# Altium project Planter.PrjPcb
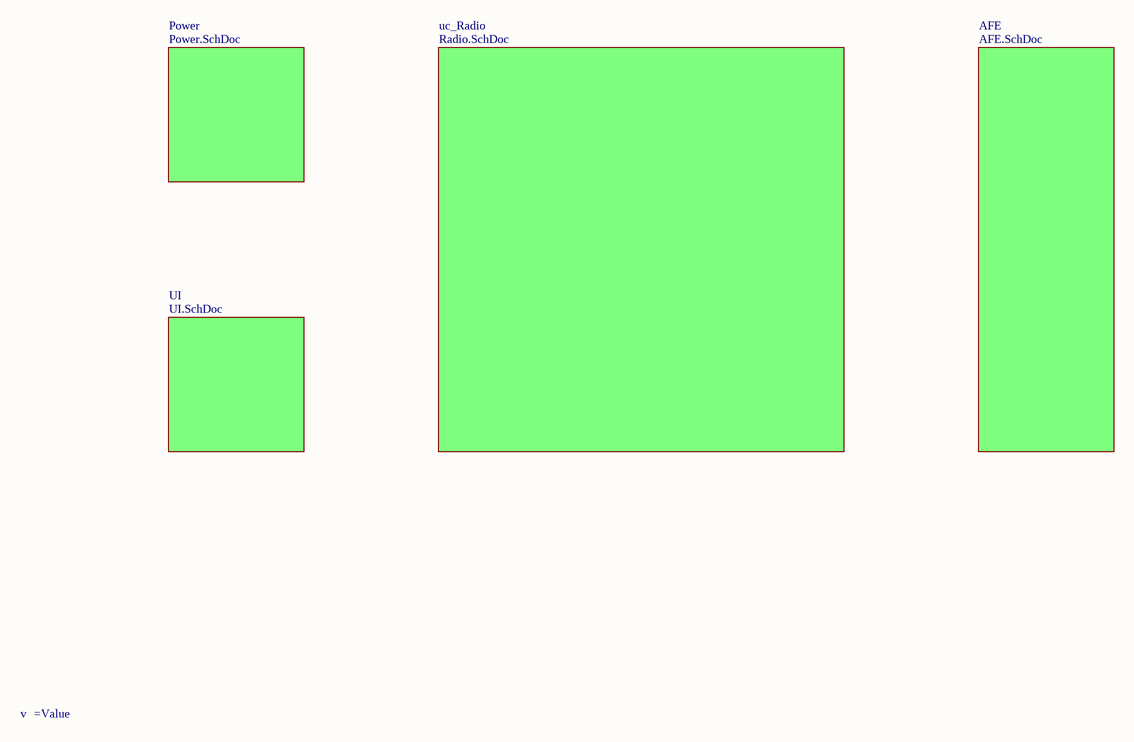
[diagram p0: Planter.SchDoc]
5 sheets, 45 parts. Net scope: global (net labels, ports and power ports of the same name join across sheets).
Board file: Planter.PcbDoc
Sheets:
  Planter.SchDoc
    uc_Radio = radio.SchDoc
    Power = power.SchDoc
    AFE = AFE.SchDoc
    UI = UI.SchDoc

## Sheet Planter.SchDoc: Plant - Block Diagram
size A4; Author: Carlos de la Fuente; DrawnBy: Carlos de la Fuente; Engineer: Carlos de la Fuente; DocumentNumber: 1; Revision: 0.2; SheetNumber: 1; SheetTotal: 5

### Parts
v  Version  [VERSION]  (value not drawn)  (no BOM)

### Sub-sheets
AFE = AFE.SchDoc: no entries
Power = Power.SchDoc: no entries
uc_Radio = Radio.SchDoc: no entries
UI = UI.SchDoc: no entries

### Notes on the sheet
- Title
- Size:
- Date:
- A4
- Project:
- Time:
- Sheet
- Drawn By:
- Revision:
- of
- File:

### Library data of the parts
v = Version: Silkscreen version; Value: 0.2; Part Number: Version; Revision Date: 15/04/2019; Creation Date: 15/04/2019

## Sheet radio.SchDoc: Plant - Radio
size A4; Author: Carlos de la Fuente; DrawnBy: Carlos de la Fuente; DocumentNumber: Radio; Revision: 0.2; SheetNumber: 2; SheetTotal: 5
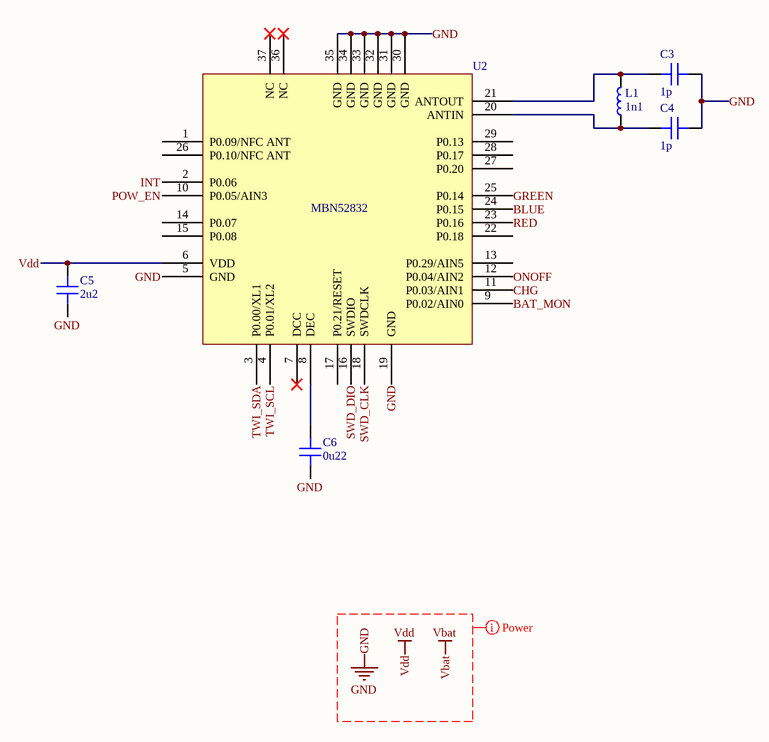
[diagram p1: radio.SchDoc]

### Parts
C3  1p  [CAP 0201/0603]
C4  1p  [CAP 0201/0603]
C5  2u2  [CAP 0402/1005]
C6  0u22  [CAP 0201/0603]
L1  1n1  [FER 0201/0603]
U2  MBN52832  [Murata MBN52832]

### Nets
GND: C3.2 C4.2 C5.1 C6.1 U2.5(GND) U2.19(GND) U2.30(GND) U2.31(GND) U2.32(GND) U2.33(GND) U2.34(GND) U2.35(GND)
Vdd: C5.2 U2.6(VDD)
BAT_MON: U2.9(P0.02/AIN0)
BLUE: U2.24(P0.15)
CHG: U2.11(P0.03/AIN1)
GREEN: U2.25(P0.14)
INT: U2.2(P0.06)
ONOFF: U2.12(P0.04/AIN2)
POW_EN: U2.10(P0.05/AIN3)
RED: U2.23(P0.16)
SWD_CLK: U2.18(SWDCLK)
SWD_DIO: U2.16(SWDIO)
TWI_SCL: U2.4(P0.01/XL2)
TWI_SDA: U2.3(P0.00/XL1)
NetC3_1: C3.1 L1.2 U2.21(ANTOUT)
NetC4_1: C4.1 L1.1 U2.20(ANTIN)
NetC6_2: C6.2 U2.8(DEC)

Not connected (* = marked no-connect by the designer): U2 1(P0.09/NFC_ANT) 7(DCC)* 13(P0.29/AIN5) 14(P0.07) 15(P0.08) 17(P0.21/RESET) 22(P0.18) 26(P0.10/NFC_ANT) 27(P0.20) 28(P0.17) 29(P0.13) 36(NC)* 37(NC)*

### Layout directives
net class Power: GND, Vbat, Vdd

### Notes on the sheet
- Title
- Size:
- Date:
- A4
- Project:
- Time:
- Sheet
- Drawn By:
- Revision:
- of
- File:

### Library data of the parts
C3 C4 = GRM0335C1H1R0BA01D: CAP CER 0201 1pF 50V ±0.1pF C0G; Manufacturer: Murata; Value: 1p; Part Number: GRM0335C1H1R0BA01D; Creation Date: 02/07/2019; Revision Date: 02/07/2019; Supplier 1: Digi-Key; Supplier Part Number 1: 490-9660-1-ND; Manufacturer Part Number: GRM0335C1H1R0BA01D; Stock 1: 521200; Pricing 1: 1=0,10000, 10=0,02000, 100=0,00900, 500=0,00644, 1000=0,00506, 2500=0,00460, 5000=0,00423 (USD); RoHS: Yes; Mount: Surface Mount; Case/Package: 0201; Min Operating Temperature: -55°C; Max Operating Temperature: 125°C; Packaging: Tape and Reel; Voltage Rating (DC): 50V; Length: 0.024inch; Width: 0.012inch; Depth: 0.3mm; ComponentLink1URL: https://datasheet.ciiva.com/29538/partnumbering-e-01-29538566.pdf?src-supplier=Digi-Key; ComponentLink1Description: https://datasheet.ciiva.com/29538/partnumbering-e-01-29538566.pdf?src-supplier=Digi-Key; Case Code (Imperial): 0201; Case Code (Metric): 0603; Voltage Rating: 50V; Package Quantity: 15000; Termination: SMD/SMT; Capacitance: 1pF; Dielectric: C0G; Thickness: 0.013inch
C5 = GRM155R61C225KE11D: CAP CER 0402 2.2uF 16V 10% X5R; Manufacturer: Murata; Note: recommended; Material: Ceramic; Value: 2u2; Part Number: GRM155R61C225KE11D; Supplier 1: Digi-Key; Supplier Part Number 1: 490-10695-1-ND; Manufacturer Part Number: GRM155R61C225KE11D; Stock 1: 2251620; Pricing 1: 1=0,23000, 10=0,15900, 100=0,08990, 500=0,06348, 1000=0,05555, 2500=0,05290, 5000=0,04893 (USD); RoHS: Yes; Mount: Surface Mount; Case/Package: 0402; Min Operating Temperature: -55°C; Max Operating Temperature: 85°C; Tolerance: 10%; Packaging: Tape and Reel; Voltage Rating (DC): 16V; Length: 0.039inch; Height: 0.3mm; Width: 0.02inch; ComponentLink1URL: http://components.arrow.com/part/dataview/0323_07281440?src-supplier=Arrow+Europe; ComponentLink1Description: http://components.arrow.com/part/dataview/0323_07281440?src-supplier=Arrow+Europe; Case Code (Imperial): 0402; Case Code (Metric): 1005; Voltage Rating: 16V; Capacitance: 2.2uF; Thickness: 0.022inch; ComponentLink2URL: http://www.mouser.com/ds/2/281/c02e-2905.pdf?src-s; ComponentLink2Description: http://www.mouser.com/ds/2/281/c02e-2905.pdf?src-s; ComponentLink3URL: https://search.murata.co.jp/Ceramy/image/img/A01X/; ComponentLink3Description: https://search.murata.co.jp/Ceramy/image/img/A01X/; Creation Date: 10/10/2019; Revision Date: 10/10/2019
C6 = GRM033R61A224KE90D: CAP CER 0201 0.22uF 10V 10% X5R; Manufacturer: Murata; Note: recommended; Capacitance: 220nF; Value: 0u22; Part Number: GRM033R61A224KE90D; Creation Date: 19/01/2021; Revision Date: 19/01/2021; Supplier 1: Digi-Key; Supplier Part Number 1: 490-10411-1-ND; Manufacturer Part Number: GRM033R61A224KE90D; Stock 1: 951885; Pricing 1: 1=0,10000, 10=0,03600, 50=0,01980, 100=0,01620, 500=0,01156, 1000=0,00908, 2500=0,00825, 5000=0,00759 (USD); RoHS: Yes; Mount: Surface Mount; Case/Package: 0201; Min Operating Temperature: -55°C; Max Operating Temperature: 85°C; Tolerance: 10%; Packaging: Tape and Reel; Voltage Rating (DC): 10V; Length: 0.024inch; Height: 0.5mm; Width: 0.012inch; Lead Free: Lead Free; ComponentLink1URL: http://www.farnell.com/datasheets/2867835.pdf?src-supplier=Farnell; ComponentLink1Description: http://www.farnell.com/datasheets/2867835.pdf?src-supplier=Farnell; Case Code (Imperial): 0201; Case Code (Metric): 0603; Voltage Rating: 10V; Dielectric: X5R; Thickness: 0.013inch; ComponentLink2URL: http://www.mouser.com/ds/2/281/c02e-2905.pdf?src-s; ComponentLink2Description: http://www.mouser.com/ds/2/281/c02e-2905.pdf?src-s; ComponentLink3URL: http://search.murata.co.jp/Ceramy/image/img/A01X/G; ComponentLink3Description: http://search.murata.co.jp/Ceramy/image/img/A01X/G; ComponentLink4URL: http://www.farnell.com/datasheets/2867835.pdf?src-; ComponentLink4Description: http://www.farnell.com/datasheets/2867835.pdf?src-; ComponentLink5URL: http://www.mouser.com/ds/2/281/c02e-2905.pdf?src-s; ComponentLink5Description: http://www.mouser.com/ds/2/281/c02e-2905.pdf?src-s; ComponentLink6URL: http://search.murata.co.jp/Ceramy/image/img/A01X/G; ComponentLink6Description: http://search.murata.co.jp/Ceramy/image/img/A01X/G; ComponentLink7URL: http://search.murata.co.jp/Ceramy/image/img/A01X/p; ComponentLink7Description: http://search.murata.co.jp/Ceramy/image/img/A01X/p; Manufacturer 1: Murata; Manufacturer Part Number 1: GRM033R61A224KE90D; RoHS Compliant: Yes; Resistor Type: Ceramic
L1 = LQP03TN1N1B02D: IND 0201 1.1nH +-0.1nH 0.75A 0.1R; Manufacturer: Murata; Core Material: Non-Magnetic; Self Resonant Frequency: 17GHz; Shielding: Unshielded; DC Resistance (DCR): 100mR; Q Factor: 14; Current Rating: 750mA; Test Frequency: 500MHz; Value: 1n1; Part Number: LQP03TN1N1B02D; Creation Date: 10/10/2019; Revision Date: 10/10/2019; Supplier 1: Digi-Key; Supplier Part Number 1: 490-6715-1-ND; Manufacturer Part Number: LQP03TN1N1B02D; Stock 1: 87622; Pricing 1: 1=0,10000, 10=0,04700, 100=0,03110, 500=0,02588, 1000=0,02174, 2500=0,01863 (USD); RoHS: Yes; Mount: Surface Mount; Case/Package: 0201; Min Operating Temperature: -55°C; Max Operating Temperature: 125°C; Packaging: Tape and Reel; Case Code (Imperial): 0201; Case Code (Metric): 0603; Package Quantity: 15000; Termination: SMD/SMT; Composition: Thin Film; Inductance: 1.1nH; Max DC Current: 750mA
U2 = WSM-BL241-ADA-008: Bluetooth v5.0 (BLE) SMART SOC IoT/NFC 1Mbps 3.3V; Manufacturer: Murata; Frequency: 2.4GHz; Interface: I2C,SPI,UART; Sensitivity: -93dBm; Current - Receiving: 6mA; Current - Transmitting: 7mA; Memory Size: 64KB; Part Number: WSM-BL241-ADA-008; Revision Date: 10/10/2019; Creation Date: 10/10/2019; Supplier 1: Mouser; Supplier Part Number 1: 81-WSM-BL241-ADA-008; Manufacturer Part Number: WSM-BL241-ADA-008; Stock 1: 4518; Pricing 1: 1=10,84000, 10=9,78000, 25=8,93000, 50=8,93000, 10; RoHS: No; Case/Package: Module; Min Operating Temperature: -40°C; Max Operating Temperature: 85°C; Packaging: Cut Tape; Data Rate: 1Mbps; ComponentLink1URL: http://www.farnell.com/datasheets/2575837.pdf?src-; ComponentLink1Description: http://www.farnell.com/datasheets/2575837.pdf?src-; ComponentLink2URL: https://wireless.murata.com/RFM/data/mbn52832_prod; ComponentLink2Description: https://wireless.murata.com/RFM/data/mbn52832_prod; ComponentLink3URL: http://www.farnell.com/datasheets/2575837.pdf?src-; ComponentLink3Description: http://www.farnell.com/datasheets/2575837.pdf?src-; Mount: Surface Mount

## Sheet power.SchDoc: Plant - Power
size A4; Author: Carlos de la Fuente; CompanyName: ekuore; DrawnBy: Carlos de la Fuente; Engineer: Carlos de la Fuente; Organization: eKuore; Revision: 0.2; SheetNumber: 3; SheetTotal: 5
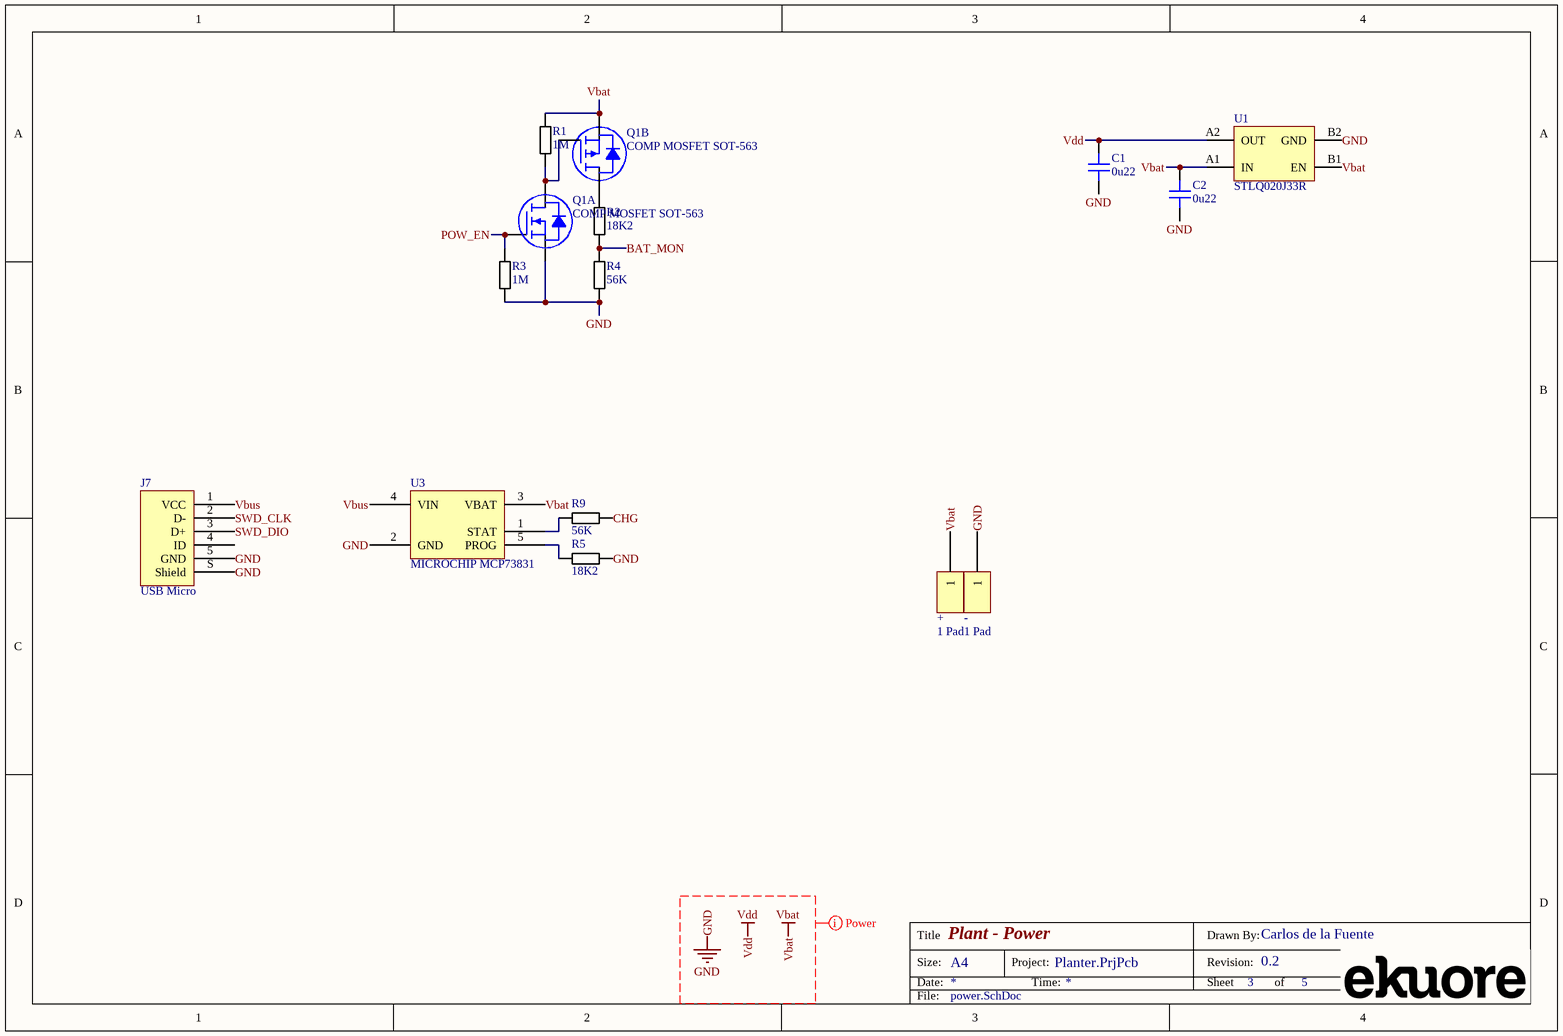
[diagram p2: power.SchDoc]

### Parts
+  1 Pad  [HARWIN P70 - CONTACT]  (no BOM)
-  1 Pad  [HARWIN P70 - CONTACT]  (no BOM)
C1  0u22  [CAP 0201/0603]
C2  0u22  [CAP 0201/0603]
J7  USB Micro  [Amphenol 10118192]
Q1  COMP MOSFET SOT-563  [ON SEMI SOT563]  (parts A,B of 2)
R1  1M  [RES 0402/1005]
R2  18K2  [RES 0402/1005]
R3  1M  [RES 0402/1005]
R4  56K  [RES 0402/1005]
R5  18K2  [RES 0402/1005]
R9  56K  [RES 0402/1005]
U1  STLQ020J33R  [ST flip-chip4]
U3  MICROCHIP MCP73831  [MICROCHIP SOT-23-5]

### Nets
GND: -.1 C1.1 C2.1 J7.5(GND) J7.S(Shield) Q1.1(S1) R3.1 R4.1 R5.1 U1.B2(GND) U3.2(GND)
Vbat: +.1 C2.2 Q1.4(S2) R1.2 U1.A1(IN) U1.B1(EN) U3.3(VBAT)
Vdd: C1.2 U1.A2(OUT)
BAT_MON: R2.1 R4.2
CHG: R9.2
POW_EN: Q1.2(G1) R3.2
SWD_CLK: J7.2(D-)
SWD_DIO: J7.3(D+)
Vbus: J7.1(VCC) U3.4(VIN)
NetQ1_3: Q1.3(D2) R2.2
NetQ1_5: Q1.5(G2) Q1.6(D1) R1.1
NetR5_2: R5.2 U3.5(PROG)
NetR9_1: R9.1 U3.1(STAT)

Not connected (* = marked no-connect by the designer): J7 4(ID)

### Layout directives
net class Power: GND, Vbat, Vdd

### Notes on the sheet
- Title
- Size:
- Date:
- A4
- Project:
- Time:
- Sheet
- Drawn By:
- Revision:
- of
- File:

### Library data of the parts
+ - = P70 - Contact: CONTACT PAD P70 Pogo pin series; Part Number: P70 - Contact; Value: PAD; Creation Date: 06/04/2021; Revision Date: 06/04/2021
C1 C2 = GRM033R61A224KE90D: as C6 on sheet radio; Value: 0u22; Part Number: GRM033R61A224KE90D; Creation Date: 19/01/2021; Revision Date: 19/01/2021; Supplier 1: Digi-Key; Supplier Part Number 1: 490-10411-1-ND; Manufacturer Part Number: GRM033R61A224KE90D; Stock 1: 951885; Pricing 1: 1=0,10000, 10=0,03600, 50=0,01980, 100=0,01620, 500=0,01156, 1000=0,00908, 2500=0,00825, 5000=0,00759 (USD); RoHS: Yes; Mount: Surface Mount; Case/Package: 0201; Min Operating Temperature: -55°C; Max Operating Temperature: 85°C; Tolerance: 10%; Packaging: Tape and Reel; Voltage Rating (DC): 10V; Length: 0.024inch; Height: 0.5mm; Width: 0.012inch; Lead Free: Lead Free; ComponentLink1URL: http://www.farnell.com/datasheets/2867835.pdf?src-supplier=Farnell; ComponentLink1Description: http://www.farnell.com/datasheets/2867835.pdf?src-supplier=Farnell; Case Code (Imperial): 0201; Case Code (Metric): 0603; Voltage Rating: 10V; Dielectric: X5R; Thickness: 0.013inch; ComponentLink2URL: http://www.mouser.com/ds/2/281/c02e-2905.pdf?src-s; ComponentLink2Description: http://www.mouser.com/ds/2/281/c02e-2905.pdf?src-s; ComponentLink3URL: http://search.murata.co.jp/Ceramy/image/img/A01X/G; ComponentLink3Description: http://search.murata.co.jp/Ceramy/image/img/A01X/G; ComponentLink4URL: http://www.farnell.com/datasheets/2867835.pdf?src-; ComponentLink4Description: http://www.farnell.com/datasheets/2867835.pdf?src-; ComponentLink5URL: http://www.mouser.com/ds/2/281/c02e-2905.pdf?src-s; ComponentLink5Description: http://www.mouser.com/ds/2/281/c02e-2905.pdf?src-s; ComponentLink6URL: http://search.murata.co.jp/Ceramy/image/img/A01X/G; ComponentLink6Description: http://search.murata.co.jp/Ceramy/image/img/A01X/G; ComponentLink7URL: http://search.murata.co.jp/Ceramy/image/img/A01X/p; ComponentLink7Description: http://search.murata.co.jp/Ceramy/image/img/A01X/p; Manufacturer 1: Murata; Manufacturer Part Number 1: GRM033R61A224KE90D; RoHS Compliant: Yes; Resistor Type: Ceramic
J7 = 10118192-0001LF: CONN RCP USB2.0 MICRO B SMD R/A; Manufacturer: Amphenol FCI; System: Connector; Current Rating: 1.8A; Gender: Receptacle; Connector Type: USB,Receptacle; Number of Contacts: 5; Pitch: 0.65mm; Part Number: 10118192-0001LF; Value: USB; Creation Date: 25/02/2020; Revision Date: 27/02/2020; Supplier 1: Digi-Key; Supplier Part Number 1: 609-4613-1-ND; Manufacturer Part Number: 10118192-0001LF; Stock 1: 20765; Pricing 1: 1=0,43000, 10=0,40500, 25=0,36480, 50=0,32420, 100=0,31070, 250=0,28368, 500=0,27016 (USD); RoHS: Yes; Mount: Surface Mount,Horizontal; Contact Material: Copper Alloy; Packaging: Tape and Reel; Package Quantity: 1400; Length: 7.86mm; REACH SVHC: No SVHC; ComponentLink1URL: https://datasheet.ciiva.com/26853/getdatasheetpartid-418041-26853891.pdf?src-supplier=Verical; ComponentLink1Description: https://datasheet.ciiva.com/26853/getdatasheetpartid-418041-26853891.pdf?src-supplier=Verical; ComponentLink2URL: https://datasheet.ciiva.com/851/10118192-851112.pdf?src-supplier=Digi-Key; ComponentLink2Description: https://datasheet.ciiva.com/851/10118192-851112.pdf?src-supplier=Digi-Key; Contact Plating: Gold; Color: Black; Housing Material: Polymer; Min Operating Temperature: -55°C; Max Operating Temperature: 85°C; Termination: Solder; Orientation: Right Angle; Depth: 5.57mm; Flammability Rating: UL94 V-0
Q1 = NTZD3155CT1G: MOSFET N/P-CH 20V 0.54A/-0.43A SOT563; Manufacturer: ON Semiconductor; Max Power Dissipation: 250mW; Number of Elements: 2; Part Number: NTZD3155CT1G; Revision Date: 27/01/2021; Creation Date: 27/01/2021; Supplier 1: Digi-Key; Supplier Part Number 1: NTZD3155CT1GOSCT-ND; Manufacturer Part Number: NTZD3155CT1G; Stock 1: 48898; Pricing 1: 1=0,49000, 10=0,34400, 25=0,32960, 100=0,17370, 50; RoHS: Yes; Case/Package: SOT-563; Number of Pins: 6; Contact Plating: Tin,Matte; Min Operating Temperature: -55°C; Max Operating Temperature: 150°C; Package Quantity: 1; Packaging: Tape and Reel
R1 R3 = RC0402FR-071ML: RES 0402 1M 1%  63mW; Manufacturer: Yageo; Note: recommended; Temperature Coefficient: 100ppm/°C; Resistance: 1MR; Value: 1M; Part Number: RC0402FR-071ML; Creation Date: 07/05/2019; Revision Date: 08/05/2019; Supplier 1: Digi-Key; Supplier Part Number 1: 311-1.00MLRCT-ND; Manufacturer Part Number: RC0402FR-071ML; Stock 1: 14535916; Pricing 1: 1 = 0,10000, 10 = 0,01600, 100 = 0,00670, 1000 = 0,00301, 2500 = 0,00261, 5000 = 0,00215 (USD); RoHS: Yes; Case/Package: 0402; Min Operating Temperature: -55°C; Max Operating Temperature: 155°C; Tolerance: 1%; Packaging: Tape and Reel; Power Rating: 63mW; Length: 1mm; Height: 0.32mm; Depth: 0.5mm; REACH SVHC: Unknown; Lead Free: Lead Free; ComponentLink1URL: https://datasheet.ciiva.com/11808/0900766b80c66297-11808125.pdf?src-supplier=RSComponents; ComponentLink1Description: https://datasheet.ciiva.com/11808/0900766b80c66297-11808125.pdf?src-supplier=RSComponents
R2 R5 = RC0402FR-0718K2L: RES 0402 18K2 1%  63mW; Manufacturer: Yageo; Note: recommended; Temperature Coefficient: 100ppm/°C; Resistance: 18.2kR; Voltage Rating (DC): 50V; Power Rating: 62.5mW; Value: 18K2; Part Number: RC0402FR-0718K2L; Creation Date: 02/07/2019; Revision Date: 02/07/2019; Supplier 1: Digi-Key; Supplier Part Number 1: YAG2371CT-ND; Manufacturer Part Number: RC0402FR-0718K2L; Stock 1: 493024; Pricing 1: 1=0,10000, 10=0,01600, 100=0,00670, 1000=0,00301, 2500=0,00261, 5000=0,00215 (USD); RoHS: Yes; Case/Package: 0402; Min Operating Temperature: -55°C; Max Operating Temperature: 155°C; Tolerance: 1%; Packaging: Tape and Reel; Length: 1mm; Height: 0.016inch; Width: 0.02inch; Depth: 0.5mm; ComponentLink1URL: https://datasheet.ciiva.com/16741/pyu-rc0402-51-rohs-l-6-r-16741879.pdf?src-supplier=Future+Electronics; ComponentLink1Description: https://datasheet.ciiva.com/16741/pyu-rc0402-51-rohs-l-6-r-16741879.pdf?src-supplier=Future+Electronics; Case Code (Imperial): 0402; Case Code (Metric): 1005; Voltage Rating: 50V; Package Quantity: 10000; Termination: SMD/SMT; Composition: Thick Film; Number of Terminations: 2; Military Standard: Not; Max Power Dissipation: 63mW; Features: Moisture Resistant; Radiation Hardening: No; ComponentLink2URL: https://datasheet.ciiva.com/2552/pyu-r-int-thick-7; ComponentLink2Description: https://datasheet.ciiva.com/2552/pyu-r-int-thick-7; ComponentLink3URL: https://datasheet.ciiva.com/5596/pyu-rc0402-51-roh; ComponentLink3Description: https://datasheet.ciiva.com/5596/pyu-rc0402-51-roh; ComponentLink4URL: https://datasheet.ciiva.com/16869/pyu-rc0402-51-ro; ComponentLink4Description: https://datasheet.ciiva.com/16869/pyu-rc0402-51-ro; ComponentLink5URL: https://datasheet.ciiva.com/28403/pyu-rc0402-51-ro; ComponentLink5Description: https://datasheet.ciiva.com/28403/pyu-rc0402-51-ro; Working Voltage: 50V; Contact Plating: Tin
R4 R9 = RC0402FR-0756KL: RES 0402 56K 1%  63mW; Manufacturer: Yageo; Temperature Coefficient: 100ppm/°C; Resistance: 56kR; Power Rating: 62.5mW; Voltage Rating: 50V; Note: recommended; Value: 56K; Part Number: RC0402FR-0756KL; Supplier 1: Digi-Key; Supplier Part Number 1: 311-56.0KLRDKR-ND; Manufacturer Part Number: RC0402FR-0756KL; Stock 1: 25395; Pricing 1: 1=0,10000, 10=0,01600, 100=0,00640, 1000=0,00289, 2500=0,00251, 5000=0,00207 (USD); RoHS: Yes; Case/Package: 0402; Min Operating Temperature: -55°C; Max Operating Temperature: 155°C; Tolerance: 1%; Packaging: Tape and Reel; Length: 1mm; Height: 0.016inch; Width: 0.02inch; Depth: 0.5mm; REACH SVHC: No SVHC; ComponentLink1URL: https://datasheet.ciiva.com/2453/pyu-r-int-thick-7-2453478.pdf?src-supplier=Digi-Key; ComponentLink1Description: https://datasheet.ciiva.com/2453/pyu-r-int-thick-7-2453478.pdf?src-supplier=Digi-Key; Case Code (Imperial): 0402; Case Code (Metric): 1005; Package Quantity: 1; Termination: SMD/SMT; Composition: Thick Film; Number of Terminations: 2; Military Standard: Not; Max Power Dissipation: 63mW; Features: Moisture Resistant; ComponentLink2URL: https://datasheet.ciiva.com/2453/pyu-r-int-thick-7; ComponentLink2Description: https://datasheet.ciiva.com/2453/pyu-r-int-thick-7; ComponentLink3URL: https://datasheet.ciiva.com/5558/pyu-rc0402-51-roh; ComponentLink3Description: https://datasheet.ciiva.com/5558/pyu-rc0402-51-roh; ComponentLink4URL: https://datasheet.ciiva.com/2453/pyu-r-int-thick-7; ComponentLink4Description: https://datasheet.ciiva.com/2453/pyu-r-int-thick-7; ComponentLink5URL: https://datasheet.ciiva.com/46412/1018594-46412840; ComponentLink5Description: https://datasheet.ciiva.com/46412/1018594-46412840; Working Voltage: 50V; ComponentLink6URL: https://datasheet.ciiva.com/7850/1018594-7850044.p; ComponentLink6Description: https://datasheet.ciiva.com/7850/1018594-7850044.p; ComponentLink7URL: https://datasheet.ciiva.com/7850/1018594-7850045.p; ComponentLink7Description: https://datasheet.ciiva.com/7850/1018594-7850045.p; Creation Date: 16/12/2020; Revision Date: 16/12/2020
U1 = STLQ020J33R: IC REG LIN 3.3V 200MA 4FLIPCHIP; Manufacturer: STMicroelectronics; Part Number: STLQ020J33R; Revision Date: 28/10/2019; Creation Date: 28/10/2019; Supplier 1: Digi-Key; Supplier Part Number 1: 497-18117-1-ND; Manufacturer Part Number: STLQ020J33R; Stock 1: 2546; Pricing 1: 1=0,57000, 10=0,49100, 100=0,36680, 500=0,28820, 1; RoHS: No; ComponentLink1URL: https://www.st.com/resource/en/datasheet/stlq020.p; ComponentLink1Description: https://www.st.com/resource/en/datasheet/stlq020.p
U3 = MCP73831T-2ACI/OT: MICROCHIP - MCP73831T-2ACI/OT - LI-ION/LI-POLY CHA; Number of Cells: 1; Output Voltage: 4.2V; Max Supply Voltage: 6V; Min Supply Voltage: 3.75V; Output Current: 500mA; Max Output Voltage: 4.5V; Min Output Voltage: 4.168V; Max Power Dissipation: 1.54W; Drain to Source Resistance: 350mR; Voltage Rating: 4.534V; Part Number: MCP73831T-2ACI/OT; Revision Date: 08/05/2019; Creation Date: 08/05/2019; Supplier 1: Digi-Key; Supplier Part Number 1: MCP73831T-2ACI/OTDKR-ND; Manufacturer: Microchip; Manufacturer Part Number: MCP73831T-2ACI/OT; Stock 1: 40920; Pricing 1: 1 = 0,58000, 25 = 0,48400, 100 = 0,43260 (USD); RoHS: Yes; Mount: Surface Mount; Case/Package: SOT-23; Number of Pins: 5; Weight: 0.00709oz; Contact Plating: Tin; Min Operating Temperature: -40°C; Max Operating Temperature: 85°C; Packaging: Tape and Reel; Max Charge Current: 500mA; Max Input Voltage: 6V; Number of Outputs: 1; Number of Channels: 1; Termination: SMD/SMT; Length: 0.122inch; Height: 0.051inch; Width: 0.071inch; Radiation Hardening: No; REACH SVHC: No SVHC; Lead Free: Lead Free; ComponentLink1URL: https://datasheet.ciiva.com/22828/0900766b80d2b53a; ComponentLink1Description: https://datasheet.ciiva.com/22828/0900766b80d2b53a

## Sheet AFE.SchDoc: Plant - AFE
size A4; Author: Carlos de la Fuente; CompanyName: ekuore; DrawnBy: Carlos de la Fuente; Engineer: Carlos de la Fuente; Organization: eKuore; Revision: 0.2; SheetNumber: 4; SheetTotal: 5
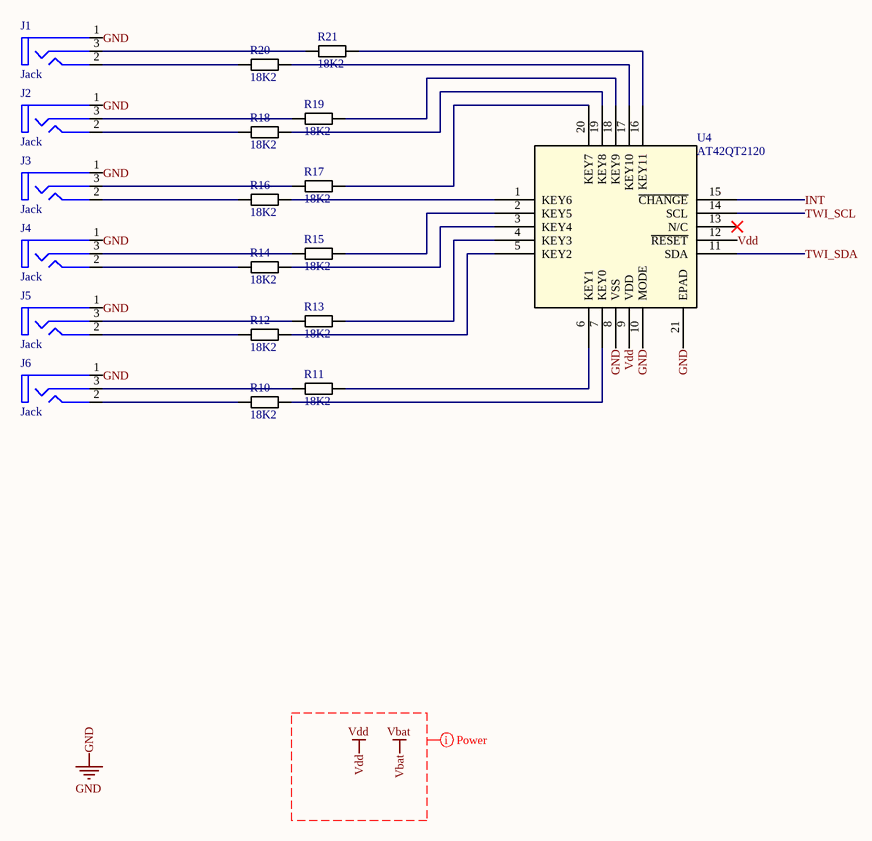
[diagram p3: AFE.SchDoc]

### Parts
J1  Jack  [CUI INC SJ2-2510XA]
J2  Jack  [CUI INC SJ2-2510XA]
J3  Jack  [CUI INC SJ2-2510XA]
J4  Jack  [CUI INC SJ2-2510XA]
J5  Jack  [CUI INC SJ2-2510XA]
J6  Jack  [CUI INC SJ2-2510XA]
R10  18K2  [RES 0402/1005]
R11  18K2  [RES 0402/1005]
R12  18K2  [RES 0402/1005]
R13  18K2  [RES 0402/1005]
R14  18K2  [RES 0402/1005]
R15  18K2  [RES 0402/1005]
R16  18K2  [RES 0402/1005]
R17  18K2  [RES 0402/1005]
R18  18K2  [RES 0402/1005]
R19  18K2  [RES 0402/1005]
R20  18K2  [RES 0402/1005]
R21  18K2  [RES 0402/1005]
U4  AT42QT2120  [MICROCHIP VQFN-20]

### Nets
GND: J1.1(Sleeve) J2.1(Sleeve) J3.1(Sleeve) J4.1(Sleeve) J5.1(Sleeve) J6.1(Sleeve) U4.8(VSS) U4.10(MODE) U4.21(EPAD)
Vdd: U4.9(VDD) U4.12(~{RESET})
INT: U4.15(~{CHANGE})
TWI_SCL: U4.14(SCL)
TWI_SDA: U4.11(SDA)
NetJ1_2: J1.2(Tip) R20.1
NetJ1_3: J1.3(Ring) R21.1
NetJ2_2: J2.2(Tip) R18.1
NetJ2_3: J2.3(Ring) R19.1
NetJ3_2: J3.2(Tip) R16.1
NetJ3_3: J3.3(Ring) R17.1
NetJ4_2: J4.2(Tip) R14.1
NetJ4_3: J4.3(Ring) R15.1
NetJ5_2: J5.2(Tip) R12.1
NetJ5_3: J5.3(Ring) R13.1
NetJ6_2: J6.2(Tip) R10.1
NetJ6_3: J6.3(Ring) R11.1
NetR10_2: R10.2 U4.7(KEY0)
NetR11_2: R11.2 U4.6(KEY1)
NetR12_2: R12.2 U4.5(KEY2)
NetR13_2: R13.2 U4.4(KEY3)
NetR14_2: R14.2 U4.3(KEY4)
NetR15_2: R15.2 U4.2(KEY5)
NetR16_2: R16.2 U4.1(KEY6)
NetR17_2: R17.2 U4.20(KEY7)
NetR18_2: R18.2 U4.19(KEY8)
NetR19_2: R19.2 U4.18(KEY9)
NetR20_2: R20.2 U4.17(KEY10)
NetR21_2: R21.2 U4.16(KEY11)

Not connected (* = marked no-connect by the designer): U4 13(N/C)*

### Layout directives
net class Power: Vbat, Vdd

### Notes on the sheet
- Title
- Size:
- Date:
- A4
- Project:
- Time:
- Sheet
- Drawn By:
- Revision:
- of
- File:

### Library data of the parts
J1-J6 = SJ2-25103A-SMT-TR: CONN JACK STEREO 2.5MM SMD R/A; Manufacturer: CUI; Current Rating: 1A; Gender: Female; Shielding: Unshielded; Number of Conductors: 3; Number of Ports: 1; Part Number: SJ2-25103A-SMT-TR; Value: Jack; Creation Date: 14/07/2021; Revision Date: 14/07/2021; Supplier 1: Digi-Key; Supplier Part Number 1: CP-SJ2-25103A-SMT-CT-ND; Stock 1: 972; RoHS: Yes; Mount: Surface Mount; Contact Material: Copper Alloy; Packaging: Tape and Reel; ComponentLink1URL: https://www.cui.com/product/resource/digikeypdf/sj2-2510x-smt.pdf?src-supplier=Digi-Key; ComponentLink1Description: https://www.cui.com/product/resource/digikeypdf/sj2-2510x-smt.pdf?src-supplier=Digi-Key; Contact Plating: Silver; Color: Black; Housing Material: Nylon; Min Operating Temperature: -25°C; Max Operating Temperature: 85°C; Termination: Solder; Connector Type: Jack; Orientation: Horizontal; Manufacturer 1: CUI; Manufacturer Part Number 1: SJ2-25103A-SMT-TR
R10-R21 = RC0402FR-0718K2L: as R2 on sheet power; Value: 18K2; Part Number: RC0402FR-0718K2L; Creation Date: 02/07/2019; Revision Date: 02/07/2019; Supplier 1: Digi-Key; Supplier Part Number 1: YAG2371CT-ND; Manufacturer Part Number: RC0402FR-0718K2L; Stock 1: 493024; Pricing 1: 1=0,10000, 10=0,01600, 100=0,00670, 1000=0,00301, 2500=0,00261, 5000=0,00215 (USD); RoHS: Yes; Case/Package: 0402; Min Operating Temperature: -55°C; Max Operating Temperature: 155°C; Tolerance: 1%; Packaging: Tape and Reel; Length: 1mm; Height: 0.016inch; Width: 0.02inch; Depth: 0.5mm; ComponentLink1URL: https://datasheet.ciiva.com/16741/pyu-rc0402-51-rohs-l-6-r-16741879.pdf?src-supplier=Future+Electronics; ComponentLink1Description: https://datasheet.ciiva.com/16741/pyu-rc0402-51-rohs-l-6-r-16741879.pdf?src-supplier=Future+Electronics; Case Code (Imperial): 0402; Case Code (Metric): 1005; Voltage Rating: 50V; Package Quantity: 10000; Termination: SMD/SMT; Composition: Thick Film; Number of Terminations: 2; Military Standard: Not; Max Power Dissipation: 63mW; Features: Moisture Resistant; Radiation Hardening: No; ComponentLink2URL: https://datasheet.ciiva.com/2552/pyu-r-int-thick-7; ComponentLink2Description: https://datasheet.ciiva.com/2552/pyu-r-int-thick-7; ComponentLink3URL: https://datasheet.ciiva.com/5596/pyu-rc0402-51-roh; ComponentLink3Description: https://datasheet.ciiva.com/5596/pyu-rc0402-51-roh; ComponentLink4URL: https://datasheet.ciiva.com/16869/pyu-rc0402-51-ro; ComponentLink4Description: https://datasheet.ciiva.com/16869/pyu-rc0402-51-ro; ComponentLink5URL: https://datasheet.ciiva.com/28403/pyu-rc0402-51-ro; ComponentLink5Description: https://datasheet.ciiva.com/28403/pyu-rc0402-51-ro; Working Voltage: 50V; Contact Plating: Tin
U4 = AT42QT2120-MMHR: IC TOUCH SENSOR 12CH 20VQFN; Manufacturer: Microchip; Manufacturer 1: Microchip / Atmel; Interface: I2C; Number of Channels: 12; Part Number: AT42QT2120-MMHR; Value: AT42QT2120; Revision Date: 21/07/2021; Creation Date: 21/07/2021; Supplier 1: Digi-Key; Supplier Part Number 1: AT42QT2120-MMHRCT-ND; Manufacturer Part Number: AT42QT2120-MMHR; Stock 1: 1727; ComponentLink1URL: https://datasheet.ciiva.com/6483/doc9634-6483533.pdf?src-supplier=Digi-Key; ComponentLink1Description: https://datasheet.ciiva.com/6483/doc9634-6483533.pdf?src-supplier=Digi-Key; RoHS: Yes; Manufacturer Part Number 1: AT42QT2120-MMHR; Case/Package: VQFN; Min Operating Temperature: -40°C; Max Operating Temperature: 85°C; Packaging: Tape and Reel; ComponentLink2URL: https://datasheet.ciiva.com/6483/doc9634-6483527.p; ComponentLink2Description: https://datasheet.ciiva.com/6483/doc9634-6483527.p; ComponentLink3URL: https://datasheet.ciiva.com/6483/doc9634-6483530.p; ComponentLink3Description: https://datasheet.ciiva.com/6483/doc9634-6483530.p; Package Quantity: 1; Series: QTouch™; RoHS Compliant: Yes

## Sheet UI.SchDoc: Plant - UI
size A4; Author: Carlos de la Fuente; CompanyName: eKuore; DrawnBy: Carlos de la Fuente; Engineer: Carlos de la Fuente; Organization: eKuore; Revision: 0.2; SheetNumber: 5; SheetTotal: 5
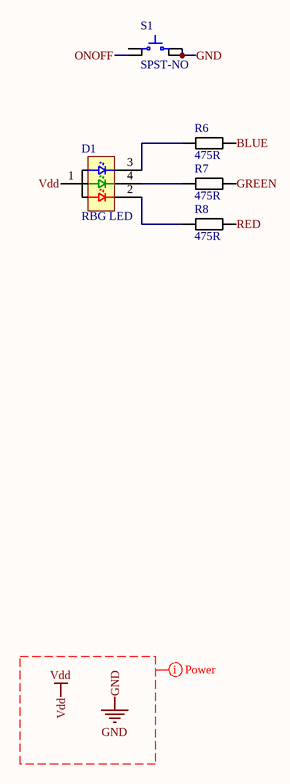
[diagram p4: UI.SchDoc]

### Parts
D1  RBG LED  [LED 0101/0404 RGB]
R6  475R  [RES 0402/1005]
R7  475R  [RES 0402/1005]
R8  475R  [RES 0402/1005]
S1  SPST-NO  [Panasonic evqp7]

### Nets
GND: S1.2 S1.2'
Vdd: D1.1(A)
BLUE: R6.2
GREEN: R7.2
ONOFF: S1.1'
RED: R8.2
NetD1_2: D1.2(C2) R8.1
NetD1_3: D1.3(C3) R6.1
NetD1_4: D1.4(C4) R7.1

Not connected (* = marked no-connect by the designer): S1 1

### Layout directives
net class Power: GND, Vdd

### Notes on the sheet
- Title
- Size:
- Date:
- A4
- Project:
- Time:
- Sheet
- Drawn By:
- Revision:
- of
- File:

### Library data of the parts
D1 = SML-LX0404SIUPGUSB: LED 0404 RBG; Manufacturer: Lumex; Value: RGB; Color: Blue; Viewing Angle: 120°; Forward Current: 2mA; Forward Voltage: 2.73V; Luminous Intensity: 20mcd; Lens Style: Square; Number of LEDs: 3; Power Rating: 30mW; Lens Color: Colorless; Lens Transparency: Clear; Wavelength: 465nm; Part Number: SML-LX0404SIUPGUSB; Revision Date: 08/05/2019; Creation Date: 06/05/2019; Supplier 1: Digi-Key; Supplier Part Number 1: 67-2125-1-ND; Manufacturer Part Number: SML-LX0404SIUPGUSB; Stock 1: 106243; Pricing 1: 1 = 1,29000, 10 = 1,04700, 25 = 0,80560, 100 = 0,7; RoHS: Yes; Mount: Surface Mount; Case/Package: 0404; Case Code (Metric): 1010; Case Code (Imperial): 0404; Min Operating Temperature: -40°C; Max Operating Temperature: 85°C; Package Quantity: 2000; Packaging: Tape and Reel; Test Current: 2mA; Length: 1mm; Height: 0.3mm; Width: 1mm; Lead Free: Lead Free; ComponentLink1URL: https://datasheet.ciiva.com/1333/lumex-quasarbrite; ComponentLink1Description: https://datasheet.ciiva.com/1333/lumex-quasarbrite; ComponentLink2URL: https://datasheet.ciiva.com/4689/sml-lx0404siupgus; ComponentLink2Description: https://datasheet.ciiva.com/4689/sml-lx0404siupgus; ComponentLink3URL: https://datasheet.ciiva.com/1246/1423960-1246392.p; ComponentLink3Description: https://datasheet.ciiva.com/1246/1423960-1246392.p; ComponentLink4URL: https://datasheet.ciiva.com/2118/sml-lx0404siupgus; ComponentLink4Description: https://datasheet.ciiva.com/2118/sml-lx0404siupgus; ComponentLink5URL: https://datasheet.ciiva.com/16199/sml-lx0404siupgu; ComponentLink5Description: https://datasheet.ciiva.com/16199/sml-lx0404siupgu; ComponentLink6URL: https://datasheet.ciiva.com/14604/70127422-1460494; ComponentLink6Description: https://datasheet.ciiva.com/14604/70127422-1460494; REACH SVHC: No SVHC; ComponentLink7URL: https://datasheet.ciiva.com/1246/1484526-1246779.p; ComponentLink7Description: https://datasheet.ciiva.com/1246/1484526-1246779.p; ComponentLink8URL: https://datasheet.ciiva.com/2118/sml-lx0404siupgus; ComponentLink8Description: https://datasheet.ciiva.com/2118/sml-lx0404siupgus; ComponentLink9URL: https://datasheet.ciiva.com/2118/sml-lx0404siupgus; ComponentLink9Description: https://datasheet.ciiva.com/2118/sml-lx0404siupgus
R6-R8 = RC0402FR-07475RL: RES 0402 475R 1%  63mW; Manufacturer: Yageo; Note: recommended; Voltage Rating (DC): 50V; Power Rating: 62.5mW; Value: 475R; Part Number: RC0402FR-07475RL; Creation Date: 06/05/2019; Revision Date: 08/05/2019; Supplier 1: Digi-Key; Supplier Part Number 1: 311-475LRCT-ND; Manufacturer Part Number: RC0402FR-07475RL; Stock 1: 2078167; Pricing 1: 1 = 0,10000, 10 = 0,01600, 100 = 0,00670, 1000 = 0,00301, 2500 = 0,00261, 5000 = 0,00215 (USD); RoHS: No; Case/Package: 0402; Tolerance: 1%; Resistance: 475R; Packaging: Cut Tape; Length: 1mm; Lead Free: Lead Free; ComponentLink1URL: http://www.yageo.com/documents/recent/PYu-RC_Group_51_RoHS_L_10.pdf?src-supplier=Digi-Key; ComponentLink1Description: http://www.yageo.com/documents/recent/PYu-RC_Group_51_RoHS_L_10.pdf?src-supplier=Digi-Key
S1 = EVQ-P7A01P: Switch Tactile N.O. SPST Right Angle 0.05A 12V; Manufacturer: Panasonic; Mechanical Life: 100000Cycles; Operating Force: 2.2N; Illumination Type: Non-Illuminated; Switch Travel: 0.2mm; Switch Function: Off-Mom; Contact Resistance: 500mR; Contact Current Rating: 50mA; Actuator Length: 0.65mm; Part Number: EVQ-P7A01P; Revision Date: 08/05/2019; Creation Date: 08/05/2019; Supplier 1: Digi-Key; Supplier Part Number 1: P16763CT-ND; Manufacturer Part Number: EVQ-P7A01P; Stock 1: 641; RoHS: Yes; Mount: Surface Mount; Case/Package: SMD/SMT; Min Operating Temperature: -20°C; Max Operating Temperature: 70°C; Packaging: Tape and Reel; Throw Configuration: SPST; Termination: Gull Wing; Package Quantity: 1; Orientation: Right Angle; ComponentLink1URL: https://datasheet.ciiva.com/30108/atk0000ce20-3010; ComponentLink1Description: https://datasheet.ciiva.com/30108/atk0000ce20-3010; Pricing 1: 1=0,30000, 10=0,28800, 25=0,27840, 50=0,26860, 100; Max Voltage Rating (DC): 12V; Electrical Life: 100000Cycles; Radiation Hardening: No; REACH SVHC: Unknown

## Nets that join several sheets
GND: radio (12 pins), power (11 pins), AFE (9 pins), UI (S1.2 S1.2')
Vdd: radio (C5.2 U2.6), power (C1.2 U1.A2), AFE (U4.9 U4.12), UI (D1.1)
BAT_MON: radio (U2.9), power (R2.1 R4.2)
BLUE: radio (U2.24), UI (R6.2)
CHG: radio (U2.11), power (R9.2)
GREEN: radio (U2.25), UI (R7.2)
INT: radio (U2.2), AFE (U4.15)
ONOFF: radio (U2.12), UI (S1.1')
POW_EN: radio (U2.10), power (Q1.2 R3.2)
RED: radio (U2.23), UI (R8.2)
SWD_CLK: radio (U2.18), power (J7.2)
SWD_DIO: radio (U2.16), power (J7.3)
TWI_SCL: radio (U2.4), AFE (U4.14)
TWI_SDA: radio (U2.3), AFE (U4.11)